# Altium schematic sheet 02_V5_IO1.SchDoc
size A4
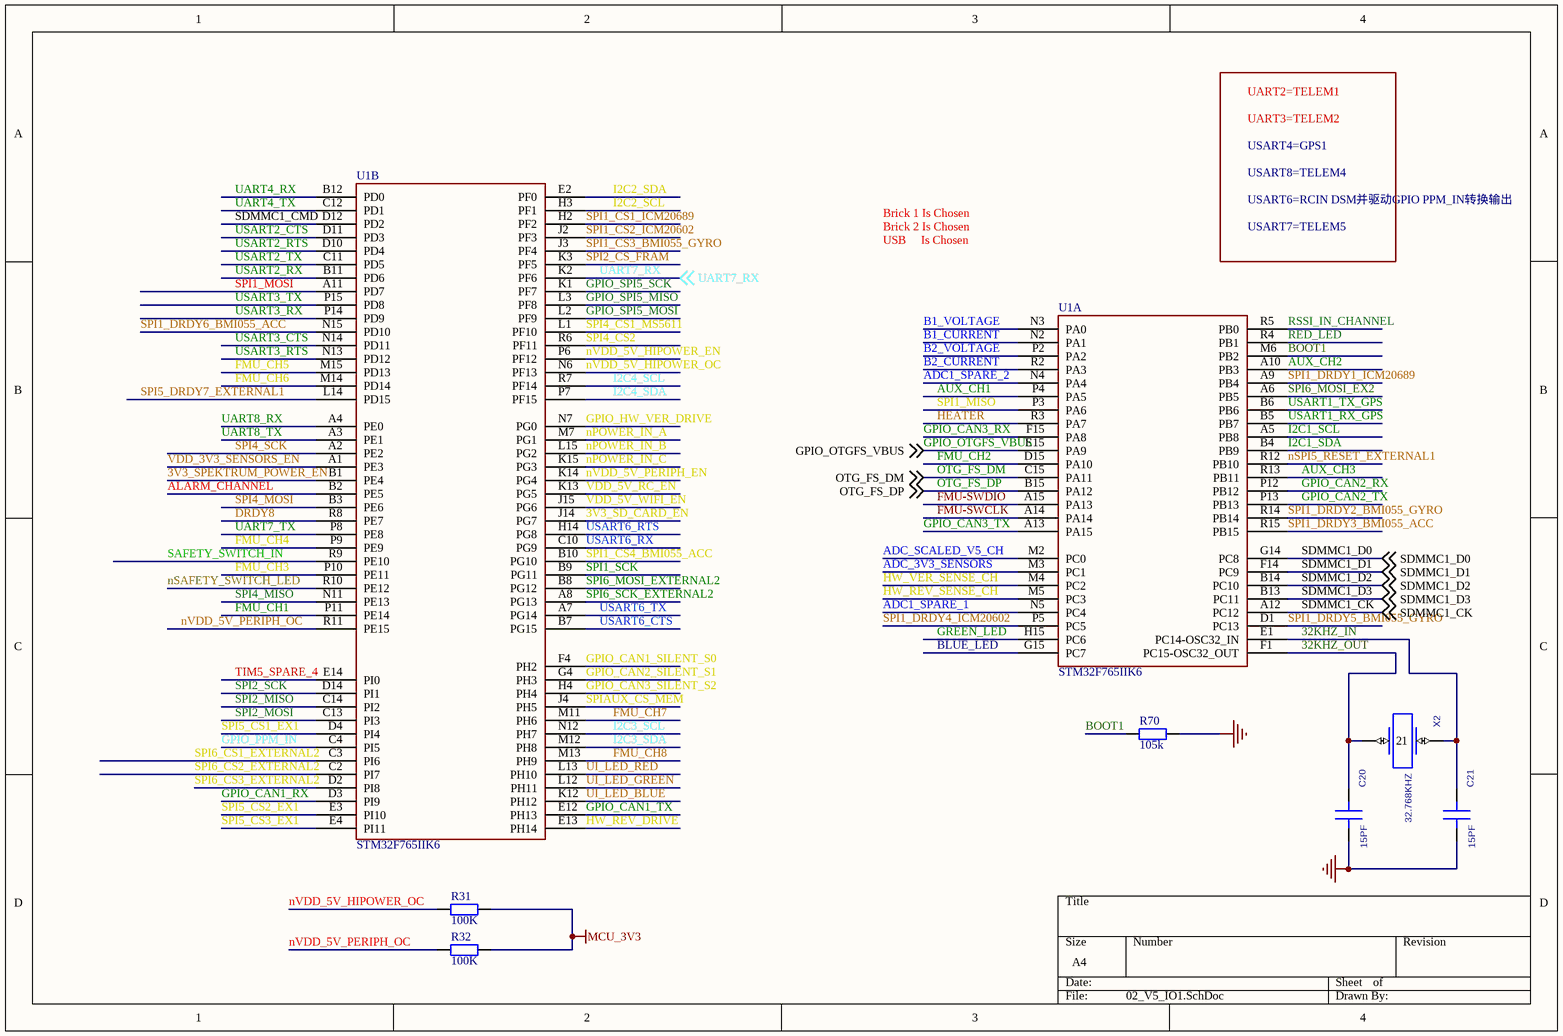
[diagram p0: 02_V5_IO1.SchDoc]

## Parts
C20  15PF  [SC0402]
C21  15PF  [SC0402]
R31  100K  [R0402]
R32  100K  [R0402]
R70  105k  [R0402]
U1  STM32F765IIK6  [UFBGA176]  (parts A,B of 3)
X2  32.768KHZ  [ABS06]

## Nets
GND: C20.2(B) C21.2(B) R70.2
MCU_3V3: R31.2 R32.2
3V3_SD_CARD_EN: U1.J14(PG7)
3V3_SPEKTRUM_POWER_EN: U1.B1(PE4)
32KHZ_IN: C21.1(A) U1.E1(PC14-OSC32_IN) X2.1
32KHZ_OUT: C20.1(A) U1.F1(PC15-OSC32_OUT) X2.2
ADC1_SPARE_1: U1.N5(PC4)
ADC1_SPARE_2: U1.N4(PA4)
ADC_3V3_SENSORS: U1.M3(PC1)
ADC_SCALED_V5_CH: U1.M2(PC0)
ALARM_CHANNEL: U1.B2(PE5)
AUX_CH1: U1.P4(PA5)
AUX_CH2: U1.A10(PB3)
AUX_CH3: U1.R13(PB11)
B1_CURRENT: U1.N2(PA1)
B1_VOLTAGE: U1.N3(PA0)
B2_CURRENT: U1.R2(PA3)
B2_VOLTAGE: U1.P2(PA2)
BLUE_LED: U1.G15(PC7)
BOOT1: R70.1 U1.M6(PB2)
DRDY8: U1.R8(PE7)
FMU-SWCLK: U1.A14(PA14)
FMU-SWDIO: U1.A15(PA13)
FMU_CH1: U1.P11(PE14)
FMU_CH2: U1.D15(PA10)
FMU_CH3: U1.P10(PE11)
FMU_CH4: U1.P9(PE9)
FMU_CH5: U1.M15(PD13)
FMU_CH6: U1.M14(PD14)
FMU_CH7: U1.M11(PH6)
FMU_CH8: U1.M13(PH9)
GPIO_CAN1_RX: U1.D3(PI9)
GPIO_CAN1_SILENT_S0: U1.F4(PH2)
GPIO_CAN1_TX: U1.E12(PH13)
GPIO_CAN2_RX: U1.P12(PB12)
GPIO_CAN2_SILENT_S1: U1.G4(PH3)
GPIO_CAN2_TX: U1.P13(PB13)
GPIO_CAN3_RX: U1.F15(PA8)
GPIO_CAN3_SILENT_S2: U1.H4(PH4)
GPIO_CAN3_TX: U1.A13(PA15)
GPIO_HW_VER_DRIVE: U1.N7(PG0)
GPIO_OTGFS_VBUS: U1.E15(PA9) ; off-sheet GPIO_OTGFS_VBUS
GPIO_PPM_IN: U1.C4(PI5)
GPIO_SPI5_MISO: U1.L3(PF8)
GPIO_SPI5_MOSI: U1.L2(PF9)
GPIO_SPI5_SCK: U1.K1(PF7)
GREEN_LED: U1.H15(PC6)
HEATER: U1.R3(PA7)
HW_REV_DRIVE: U1.E13(PH14)
HW_REV_SENSE_CH: U1.M5(PC3)
HW_VER_SENSE_CH: U1.M4(PC2)
I2C1_SCL: U1.A5(PB8)
I2C1_SDA: U1.B4(PB9)
I2C2_SCL: U1.H3(PF1)
I2C2_SDA: U1.E2(PF0)
I2C3_SCL: U1.N12(PH7)
I2C3_SDA: U1.M12(PH8)
I2C4_SCL: U1.R7(PF14)
I2C4_SDA: U1.P7(PF15)
nPOWER_IN_A: U1.M7(PG1)
nPOWER_IN_B: U1.L15(PG2)
nPOWER_IN_C: U1.K15(PG3)
nSAFETY_SWITCH_LED: U1.R10(PE12)
nSPI5_RESET_EXTERNAL1: U1.R12(PB10)
nVDD_5V_HIPOWER_EN: U1.P6(PF12)
nVDD_5V_HIPOWER_OC: R31.1 U1.N6(PF13)
nVDD_5V_PERIPH_EN: U1.K14(PG4)
nVDD_5V_PERIPH_OC: R32.1 U1.R11(PE15)
OTG_FS_DM: U1.C15(PA11) ; off-sheet OTG_FS_DM
OTG_FS_DP: U1.B15(PA12) ; off-sheet OTG_FS_DP
RED_LED: U1.R4(PB1)
RSSI_IN_CHANNEL: U1.R5(PB0)
SAFETY_SWITCH_IN: U1.R9(PE10)
SDMMC1_CK: U1.A12(PC12) ; off-sheet SDMMC1_CK
SDMMC1_CMD: U1.D12(PD2)
SDMMC1_D0: U1.G14(PC8) ; off-sheet SDMMC1_D0
SDMMC1_D1: U1.F14(PC9) ; off-sheet SDMMC1_D1
SDMMC1_D2: U1.B14(PC10) ; off-sheet SDMMC1_D2
SDMMC1_D3: U1.B13(PC11) ; off-sheet SDMMC1_D3
SPI1_CS1_ICM20689: U1.H2(PF2)
SPI1_CS2_ICM20602: U1.J2(PF3)
SPI1_CS3_BMI055_GYRO: U1.J3(PF4)
SPI1_CS4_BMI055_ACC: U1.B10(PG10)
SPI1_DRDY1_ICM20689: U1.A9(PB4)
SPI1_DRDY2_BMI055_GYRO: U1.R14(PB14)
SPI1_DRDY3_BMI055_ACC: U1.R15(PB15)
SPI1_DRDY4_ICM20602: U1.P5(PC5)
SPI1_DRDY5_BMI055_GYRO: U1.D1(PC13)
SPI1_DRDY6_BMI055_ACC: U1.N15(PD10)
SPI1_MISO: U1.P3(PA6)
SPI1_MOSI: U1.A11(PD7)
SPI1_SCK: U1.B9(PG11)
SPI2_CS_FRAM: U1.K3(PF5)
SPI2_MISO: U1.C14(PI2)
SPI2_MOSI: U1.C13(PI3)
SPI2_SCK: U1.D14(PI1)
SPI4_CS1_MS5611: U1.L1(PF10)
SPI4_CS2: U1.R6(PF11)
SPI4_MISO: U1.N11(PE13)
SPI4_MOSI: U1.B3(PE6)
SPI4_SCK: U1.A2(PE2)
SPI5_CS1_EX1: U1.D4(PI4)
SPI5_CS2_EX1: U1.E3(PI10)
SPI5_CS3_EX1: U1.E4(PI11)
SPI5_DRDY7_EXTERNAL1: U1.L14(PD15)
SPI6_CS1_EXTERNAL2: U1.C3(PI6)
SPI6_CS2_EXTERNAL2: U1.C2(PI7)
SPI6_CS3_EXTERNAL2: U1.D2(PI8)
SPI6_MOSI_EX2: U1.A6(PB5)
SPI6_MOSI_EXTERNAL2: U1.B8(PG12)
SPI6_SCK_EXTERNAL2: U1.A8(PG13)
SPIAUX_CS_MEM: U1.J4(PH5)
TIM5_SPARE_4: U1.E14(PI0)
UART4_RX: U1.B12(PD0)
UART4_TX: U1.C12(PD1)
UART7_RX: U1.K2(PF6) ; off-sheet UART7_RX
UART7_TX: U1.P8(PE8)
UART8_RX: U1.A4(PE0)
UART8_TX: U1.A3(PE1)
UI_LED_BLUE: U1.K12(PH12)
UI_LED_GREEN: U1.L12(PH11)
UI_LED_RED: U1.L13(PH10)
USART1_RX_GPS: U1.B5(PB7)
USART1_TX_GPS: U1.B6(PB6)
USART2_CTS: U1.D11(PD3)
USART2_RTS: U1.D10(PD4)
USART2_RX: U1.B11(PD6)
USART2_TX: U1.C11(PD5)
USART3_CTS: U1.N14(PD11)
USART3_RTS: U1.N13(PD12)
USART3_RX: U1.P14(PD9)
USART3_TX: U1.P15(PD8)
USART6_CTS: U1.B7(PG15)
USART6_RTS: U1.H14(PG8)
USART6_RX: U1.C10(PG9)
USART6_TX: U1.A7(PG14)
VDD_3V3_SENSORS_EN: U1.A1(PE3)
VDD_5V_RC_EN: U1.K13(PG5)
VDD_5V_WIFI_EN: U1.J15(PG6)

## Notes on the sheet
- Labels drawn without touching a wire or pin: Brick 1 Is Chosen, Brick 2 Is Chosen, UART2=TELEM1, UART3=TELEM2, USART4=GPS1, USART6=RCIN DSM并驱动GPIO PPM_IN转换输出, USART7=TELEM5, USART8=TELEM4, USB     Is Chosen

## Library data of the parts
C20 = C: PARTS: 1; OriginalSymbolOrigin: (0,30); DEVICE: C0402C150J5GAC_7867; LEVEL: STD; PINSWAP: (A,B); %208%%161%%192%%224%%195%%251%%179%%198%: SMD陶瓷电容; COMPONENT_HIGH_MAX: 0.55MM; %182%%238%%182%%168%%185%%164%%215%%247%%181%%231%%209%%185%(V): 50; %195%%232%%202%%246%: SMD陶瓷电容-50V-0.015NF-+/-5%-NP0-0402; CODE: 8070544; PKG_TYPE: SC0402
C21 = C: PARTS: 1; OriginalSymbolOrigin: (0,30); DEVICE: C0402C150J5GAC_7867; LEVEL: STD; PINSWAP: (A,B); CODE: 8070544; %195%%232%%202%%246%: SMD陶瓷电容-50V-0.015NF-+/-5%-NP0-0402; %182%%238%%182%%168%%185%%164%%215%%247%%181%%231%%209%%185%(V): 50; COMPONENT_HIGH_MAX: 0.55MM; %208%%161%%192%%224%%195%%251%%179%%198%: SMD陶瓷电容; PKG_TYPE: SC0402
R31 R32 R70 = Res2: Resistor; Value: 1K; Published: 8-Jun-2000; LatestRevisionDate: 17-Jul-2002; LatestRevisionNote: Re-released for DXP Platform.; PackageReference: AXIAL-0.4; Publisher: Altium Limited; PackageDescription: Axial Device, Thru-Hole; 2 Leads; 0.4 in Pin Spacing
X2 = X_0: PARTS: 1; OriginalSymbolOrigin: (10,40); LEVEL: STD; PKG_TYPE: HSX2-0302; DEVICE: 9H03200019; CODE: 12020212; %208%%161%%192%%224%%195%%251%%179%%198%: 晶体谐振器; COMPONENT_HIGH_MAX: 0.85MM; %195%%232%%202%%246%: 晶体谐振器-0.032768MHZ-12.5PF-+/-20PPM-70000OHM-SMD3.2*1.5